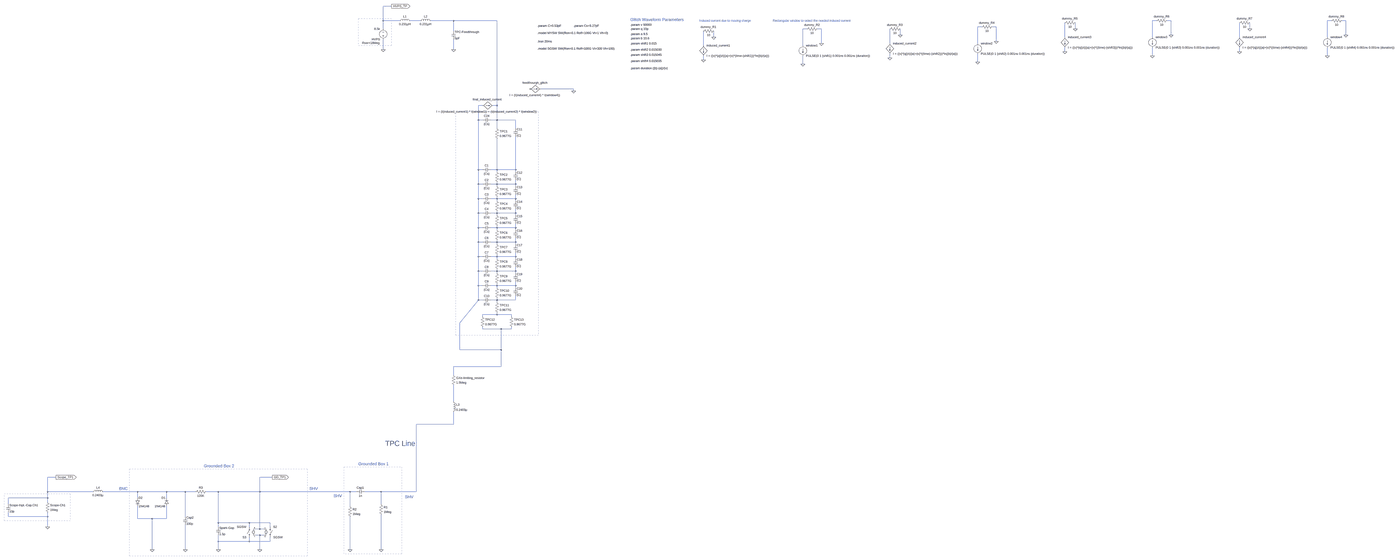
[diagram p0: schematic Feb18_glitch_current_model_miniEXO.asc, whole sheet]
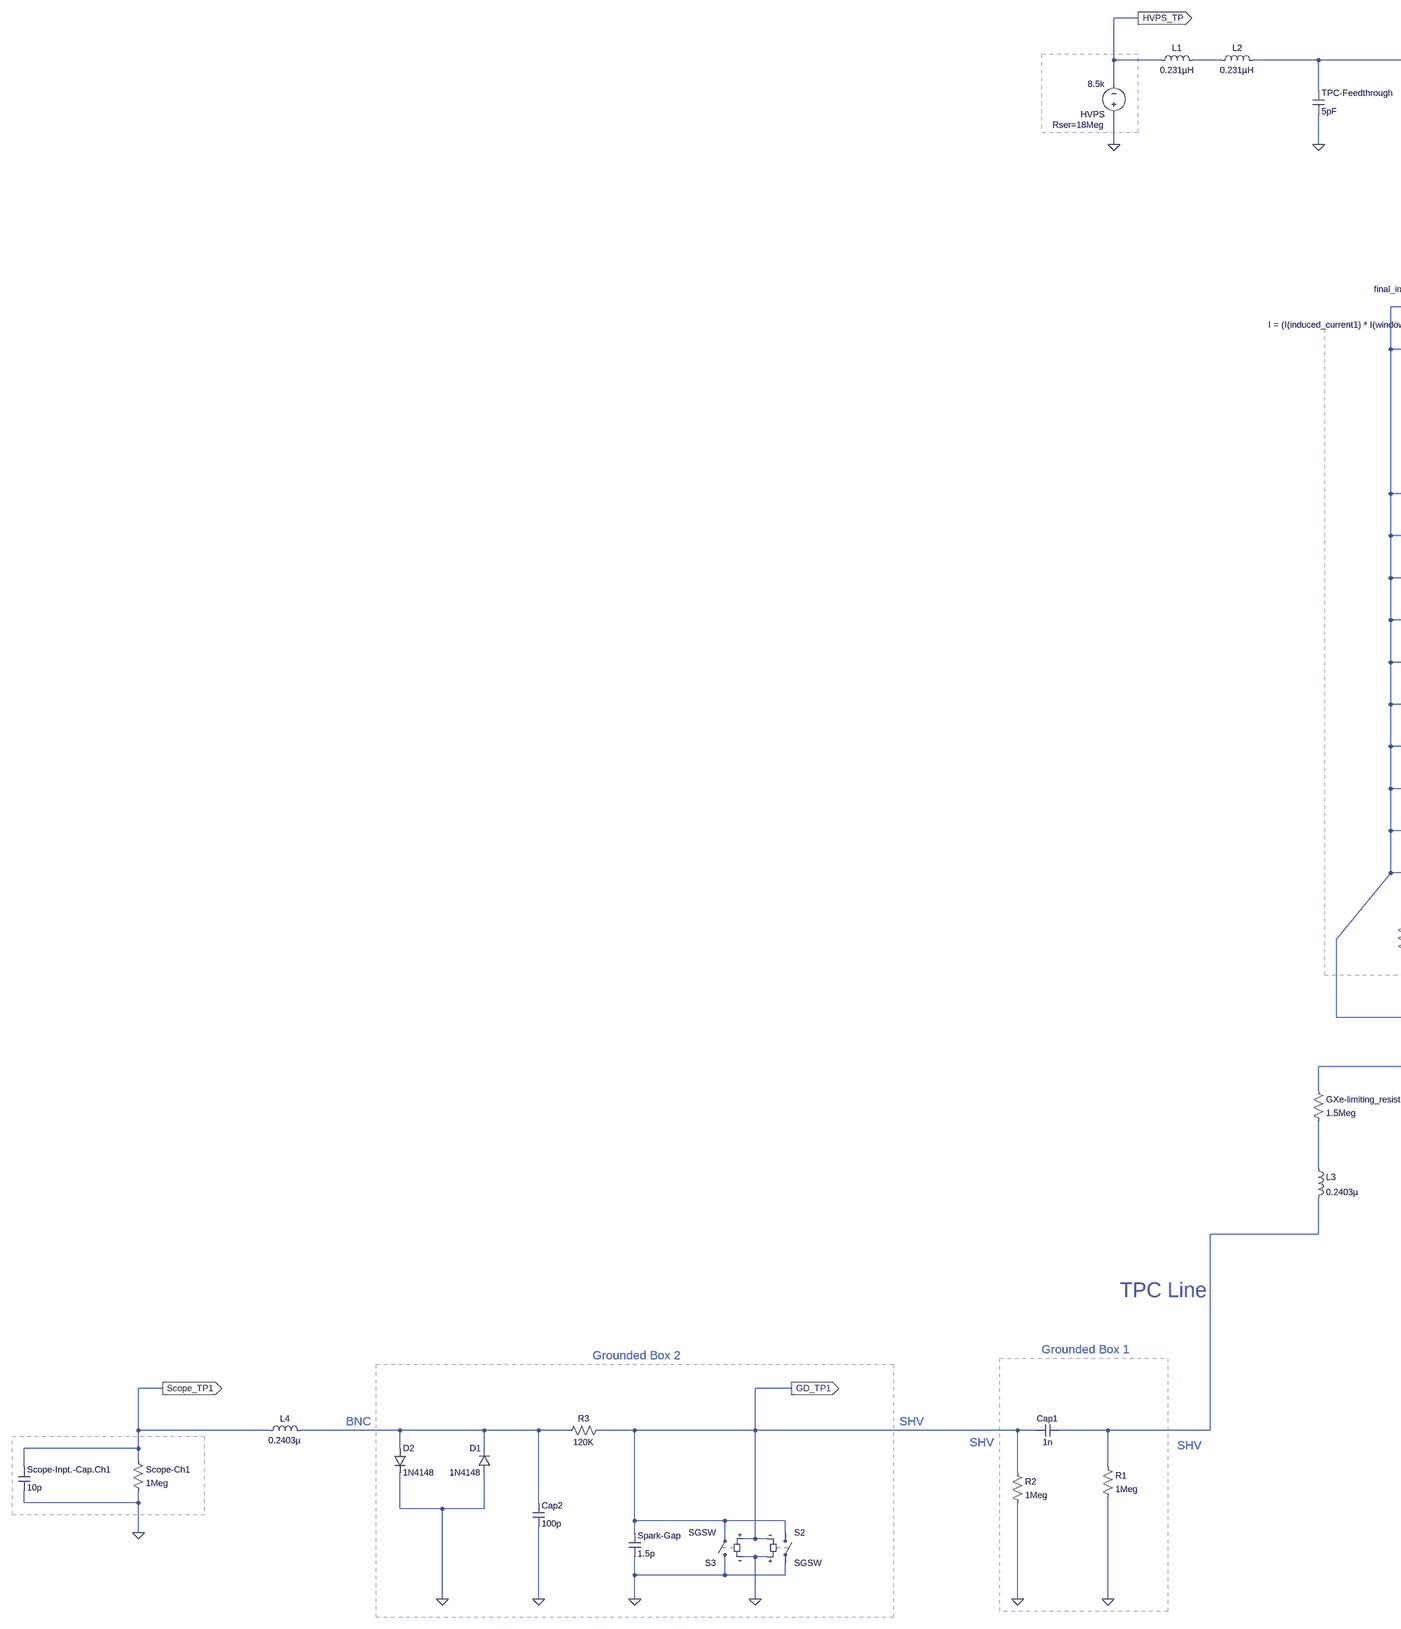
[diagram p1: schematic Feb18_glitch_current_model_miniEXO.asc, part, row 1 of 1, column 1 of 3]
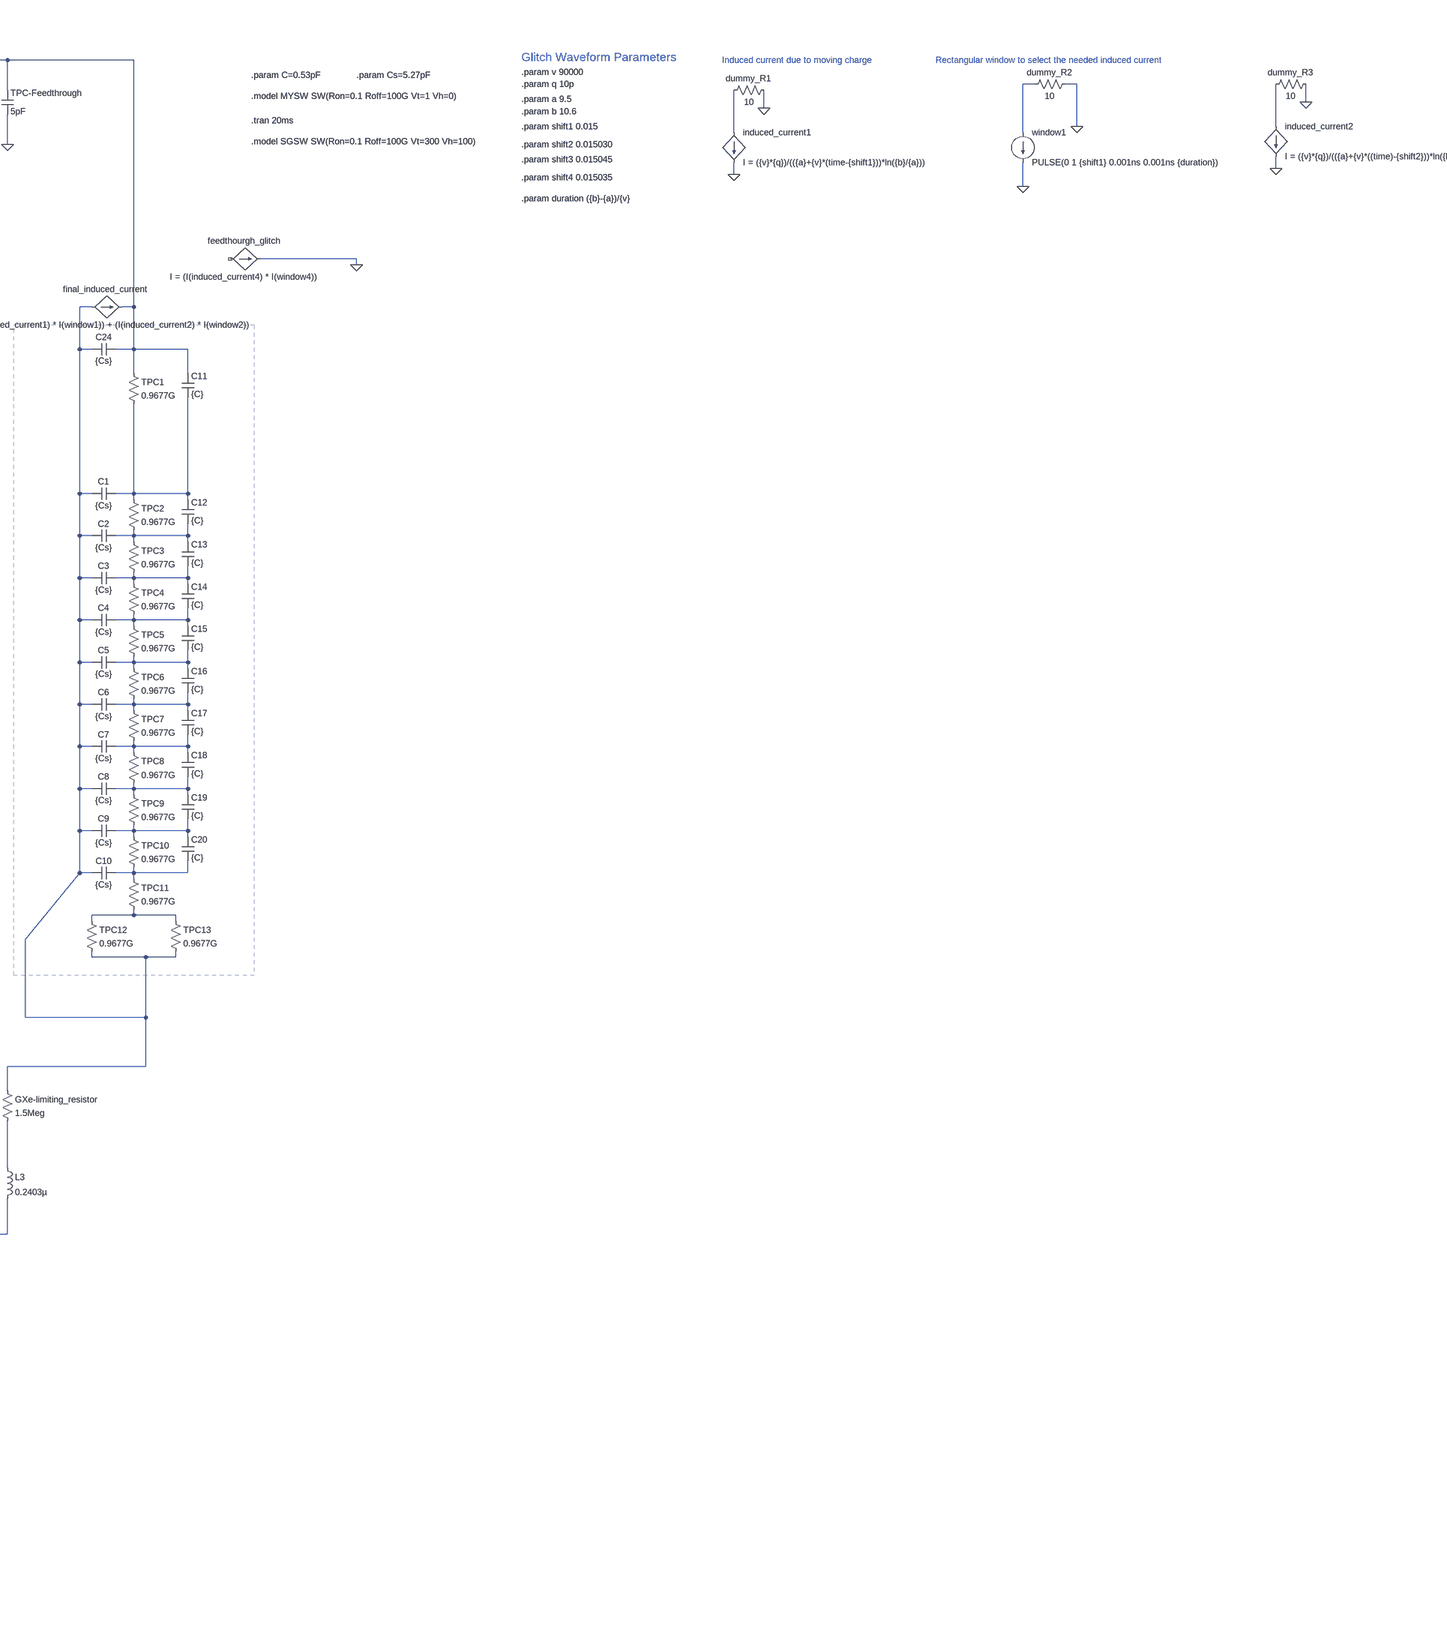
[diagram p2: schematic Feb18_glitch_current_model_miniEXO.asc, part, row 1 of 1, column 2 of 3]
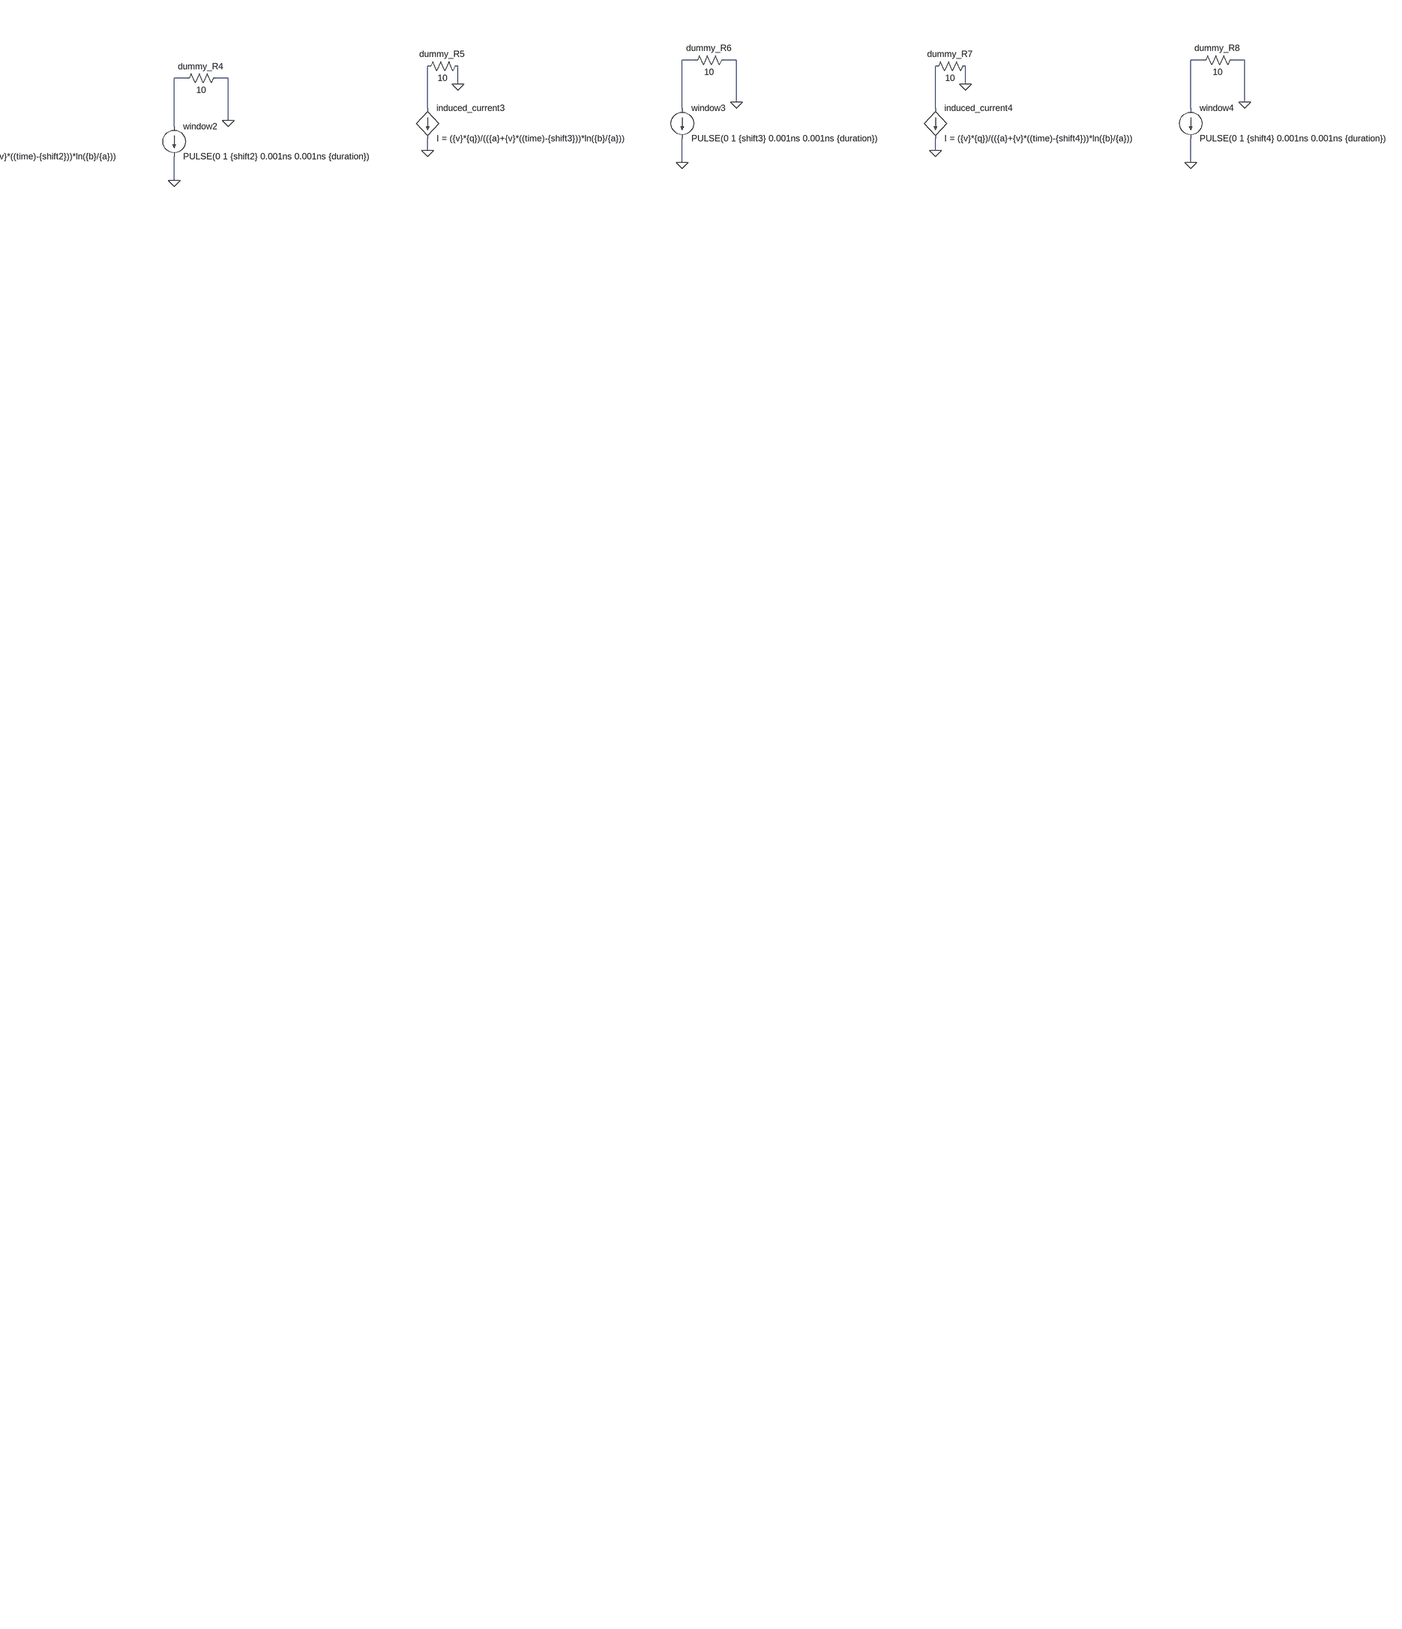
[diagram p3: schematic Feb18_glitch_current_model_miniEXO.asc, part, row 1 of 1, column 3 of 3]
Feb18_glitch_current_model_miniEXO.asc, the LTspice schematic file:
Version 4
SHEET 1 10304 3684
WIRE 224 -1072 160 -1072
WIRE 160 -960 160 -1072
WIRE 288 -960 160 -960
WIRE 448 -960 368 -960
WIRE 704 -960 528 -960
WIRE 1040 -960 704 -960
WIRE 7872 -960 7840 -960
WIRE 7984 -960 7952 -960
WIRE 9744 -960 9712 -960
WIRE 9856 -960 9824 -960
WIRE 5664 -912 5632 -912
WIRE 5776 -912 5744 -912
WIRE 160 -896 160 -960
WIRE 3904 -896 3872 -896
WIRE 4016 -896 3984 -896
WIRE 7040 -896 7040 -944
WIRE 8912 -896 8912 -944
WIRE 704 -880 704 -960
WIRE 4832 -848 4832 -896
WIRE 7984 -848 7984 -960
WIRE 9856 -848 9856 -960
WIRE 3184 -832 3184 -880
WIRE 6960 -832 6960 -944
WIRE 7840 -832 7840 -960
WIRE 8832 -832 8832 -944
WIRE 9712 -832 9712 -960
WIRE 5776 -800 5776 -912
WIRE 4016 -784 4016 -896
WIRE 4752 -784 4752 -896
WIRE 5632 -784 5632 -912
WIRE 3104 -768 3104 -880
WIRE 3872 -768 3872 -896
WIRE 160 -736 160 -816
WIRE 704 -736 704 -816
WIRE 6960 -720 6960 -752
WIRE 8832 -720 8832 -752
WIRE 7840 -688 7840 -752
WIRE 9712 -688 9712 -752
WIRE 4752 -672 4752 -704
WIRE 3104 -656 3104 -688
WIRE 5632 -640 5632 -704
WIRE 3872 -624 3872 -688
WIRE 1632 -432 1376 -432
WIRE 1632 -416 1632 -432
WIRE 928 -304 896 -304
WIRE 1040 -304 1040 -960
WIRE 1040 -304 1008 -304
WIRE 896 -192 896 -304
WIRE 928 -192 896 -192
WIRE 1040 -192 1040 -304
WIRE 1040 -192 992 -192
WIRE 1184 -192 1040 -192
WIRE 1040 -128 1040 -192
WIRE 1184 -128 1184 -192
WIRE 896 192 896 -192
WIRE 928 192 896 192
WIRE 1040 192 1040 -48
WIRE 1040 192 992 192
WIRE 1184 192 1184 -64
WIRE 1184 192 1040 192
WIRE 1040 208 1040 192
WIRE 1184 208 1184 192
WIRE 896 304 896 192
WIRE 928 304 896 304
WIRE 1040 304 1040 288
WIRE 1040 304 992 304
WIRE 1184 304 1184 272
WIRE 1184 304 1040 304
WIRE 1040 320 1040 304
WIRE 1184 320 1184 304
WIRE 896 416 896 304
WIRE 928 416 896 416
WIRE 1040 416 1040 400
WIRE 1040 416 992 416
WIRE 1184 416 1184 384
WIRE 1184 416 1040 416
WIRE 1040 432 1040 416
WIRE 1184 432 1184 416
WIRE 896 528 896 416
WIRE 928 528 896 528
WIRE 1040 528 1040 512
WIRE 1040 528 992 528
WIRE 1184 528 1184 496
WIRE 1184 528 1040 528
WIRE 1040 544 1040 528
WIRE 1184 544 1184 528
WIRE 896 640 896 528
WIRE 928 640 896 640
WIRE 1040 640 1040 624
WIRE 1040 640 992 640
WIRE 1184 640 1184 608
WIRE 1184 640 1040 640
WIRE 1040 656 1040 640
WIRE 1184 656 1184 640
WIRE 896 752 896 640
WIRE 928 752 896 752
WIRE 1040 752 1040 736
WIRE 1040 752 992 752
WIRE 1184 752 1184 720
WIRE 1184 752 1040 752
WIRE 1040 768 1040 752
WIRE 1184 768 1184 752
WIRE 896 864 896 752
WIRE 928 864 896 864
WIRE 1040 864 1040 848
WIRE 1040 864 992 864
WIRE 1184 864 1184 832
WIRE 1184 864 1040 864
WIRE 1040 880 1040 864
WIRE 1184 880 1184 864
WIRE 896 976 896 864
WIRE 928 976 896 976
WIRE 1040 976 1040 960
WIRE 1040 976 992 976
WIRE 1184 976 1184 944
WIRE 1184 976 1040 976
WIRE 1040 992 1040 976
WIRE 1184 992 1184 976
WIRE 896 1088 896 976
WIRE 928 1088 896 1088
WIRE 1040 1088 1040 1072
WIRE 1040 1088 992 1088
WIRE 1184 1088 1184 1056
WIRE 1184 1088 1040 1088
WIRE 1040 1104 1040 1088
WIRE 1184 1104 1184 1088
WIRE 896 1200 896 1088
WIRE 928 1200 896 1200
WIRE 1040 1200 1040 1184
WIRE 1040 1200 992 1200
WIRE 1184 1200 1184 1168
WIRE 1184 1200 1040 1200
WIRE 1040 1216 1040 1200
WIRE 1040 1312 1040 1296
WIRE 1040 1312 928 1312
WIRE 1152 1312 1040 1312
WIRE 928 1328 928 1312
WIRE 1152 1328 1152 1312
WIRE 752 1376 896 1200
WIRE 928 1424 928 1408
WIRE 1072 1424 928 1424
WIRE 1152 1424 1152 1408
WIRE 1152 1424 1072 1424
WIRE 752 1584 752 1376
WIRE 1072 1584 1072 1424
WIRE 1072 1584 752 1584
WIRE 1072 1792 1072 1584
WIRE 1072 1792 704 1792
WIRE 704 1856 704 1792
WIRE 704 2064 704 1936
WIRE 704 2240 704 2144
WIRE 704 2240 416 2240
WIRE -2448 3072 -2512 3072
WIRE -736 3072 -832 3072
WIRE -2512 3184 -2512 3072
WIRE -2128 3184 -2512 3184
WIRE -1776 3184 -2048 3184
WIRE -1552 3184 -1776 3184
WIRE -1408 3184 -1552 3184
WIRE -1328 3184 -1408 3184
WIRE -1152 3184 -1248 3184
WIRE -832 3184 -832 3072
WIRE -832 3184 -1152 3184
WIRE -96 3184 -832 3184
WIRE -48 3184 -96 3184
WIRE 144 3184 16 3184
WIRE 416 3184 416 2240
WIRE 416 3184 144 3184
WIRE -2512 3232 -2512 3184
WIRE -2512 3232 -2816 3232
WIRE -1776 3232 -1776 3184
WIRE -1552 3232 -1552 3184
WIRE -2512 3264 -2512 3232
WIRE -2816 3280 -2816 3232
WIRE 144 3280 144 3184
WIRE -96 3296 -96 3184
WIRE -2816 3376 -2816 3344
WIRE -2512 3376 -2512 3344
WIRE -2512 3376 -2816 3376
WIRE -1408 3376 -1408 3184
WIRE -1776 3392 -1776 3296
WIRE -1664 3392 -1776 3392
WIRE -1552 3392 -1552 3296
WIRE -1552 3392 -1664 3392
WIRE -1152 3424 -1152 3184
WIRE -912 3424 -1152 3424
WIRE -752 3424 -912 3424
WIRE -2512 3456 -2512 3376
WIRE -1152 3456 -1152 3424
WIRE -912 3456 -912 3424
WIRE -752 3456 -752 3424
WIRE -832 3472 -832 3184
WIRE -832 3472 -864 3472
WIRE -800 3472 -832 3472
WIRE -832 3520 -864 3520
WIRE -800 3520 -832 3520
WIRE -1152 3568 -1152 3520
WIRE -912 3568 -912 3536
WIRE -912 3568 -1152 3568
WIRE -752 3568 -752 3536
WIRE -752 3568 -912 3568
WIRE -1664 3632 -1664 3392
WIRE -1408 3632 -1408 3440
WIRE -1152 3632 -1152 3568
WIRE -832 3632 -832 3520
WIRE -96 3632 -96 3376
WIRE 144 3632 144 3360
FLAG -2512 3456 0
FLAG 160 -736 0
FLAG -1152 3632 0
FLAG -832 3632 0
FLAG -2448 3072 Scope_TP1
IOPIN -2448 3072 Out
FLAG -736 3072 GD_TP1
IOPIN -736 3072 Out
FLAG 224 -1072 HVPS_TP
IOPIN 224 -1072 Out
FLAG 704 -736 0
FLAG -1408 3632 0
FLAG -1664 3632 0
FLAG 144 3632 0
FLAG -96 3632 0
FLAG 3104 -656 0
FLAG 3184 -832 0
FLAG 4016 -784 0
FLAG 3872 -624 0
FLAG 4752 -672 0
FLAG 4832 -848 0
FLAG 5776 -800 0
FLAG 5632 -640 0
FLAG 6960 -720 0
FLAG 7040 -896 0
FLAG 7984 -848 0
FLAG 7840 -688 0
FLAG 8832 -720 0
FLAG 8912 -896 0
FLAG 9856 -848 0
FLAG 9712 -688 0
FLAG 1632 -416 0
SYMBOL res -2528 3248 R0
SYMATTR InstName Scope-Ch1
SYMATTR Value 1Meg
SYMATTR SpiceLine tol=1 pwr=0.5
SYMBOL voltage 160 -800 R180
WINDOW 123 0 0 Left 0
WINDOW 39 24 -12 Left 2
SYMATTR SpiceLine Rser=18Meg
SYMATTR InstName HVPS
SYMATTR Value 8.5k
SYMBOL res 1024 -144 R0
SYMATTR InstName TPC1
SYMATTR Value 0.9677G
SYMBOL res 1024 192 R0
SYMATTR InstName TPC2
SYMATTR Value 0.9677G
SYMBOL res 1024 304 R0
SYMATTR InstName TPC3
SYMATTR Value 0.9677G
SYMBOL res 1024 416 R0
SYMATTR InstName TPC4
SYMATTR Value 0.9677G
SYMBOL res 1024 528 R0
SYMATTR InstName TPC5
SYMATTR Value 0.9677G
SYMBOL res 1024 640 R0
SYMATTR InstName TPC6
SYMATTR Value 0.9677G
SYMBOL res 1024 752 R0
SYMATTR InstName TPC7
SYMATTR Value 0.9677G
SYMBOL res 1024 864 R0
SYMATTR InstName TPC8
SYMATTR Value 0.9677G
SYMBOL res 912 1312 R0
SYMATTR InstName TPC12
SYMATTR Value 0.9677G
SYMBOL res 1136 1312 R0
SYMATTR InstName TPC13
SYMATTR Value 0.9677G
SYMBOL res 1024 976 R0
SYMATTR InstName TPC9
SYMATTR Value 0.9677G
SYMBOL res 1024 1088 R0
SYMATTR InstName TPC10
SYMATTR Value 0.9677G
SYMBOL res 1024 1200 R0
SYMATTR InstName TPC11
SYMATTR Value 0.9677G
SYMBOL cap 992 176 R90
WINDOW 0 0 32 VBottom 2
WINDOW 3 32 32 VTop 2
SYMATTR InstName C1
SYMATTR Value {Cs}
SYMBOL cap 992 288 R90
WINDOW 0 0 32 VBottom 2
WINDOW 3 32 32 VTop 2
SYMATTR InstName C2
SYMATTR Value {Cs}
SYMBOL cap 992 400 R90
WINDOW 0 0 32 VBottom 2
WINDOW 3 32 32 VTop 2
SYMATTR InstName C3
SYMATTR Value {Cs}
SYMBOL cap 992 512 R90
WINDOW 0 0 32 VBottom 2
WINDOW 3 32 32 VTop 2
SYMATTR InstName C4
SYMATTR Value {Cs}
SYMBOL cap 992 624 R90
WINDOW 0 0 32 VBottom 2
WINDOW 3 32 32 VTop 2
SYMATTR InstName C5
SYMATTR Value {Cs}
SYMBOL cap 992 736 R90
WINDOW 0 0 32 VBottom 2
WINDOW 3 32 32 VTop 2
SYMATTR InstName C6
SYMATTR Value {Cs}
SYMBOL cap 992 848 R90
WINDOW 0 0 32 VBottom 2
WINDOW 3 32 32 VTop 2
SYMATTR InstName C7
SYMATTR Value {Cs}
SYMBOL cap 992 960 R90
WINDOW 0 0 32 VBottom 2
WINDOW 3 32 32 VTop 2
SYMATTR InstName C8
SYMATTR Value {Cs}
SYMBOL cap 992 1072 R90
WINDOW 0 0 32 VBottom 2
WINDOW 3 32 32 VTop 2
SYMATTR InstName C9
SYMATTR Value {Cs}
SYMBOL cap 992 1184 R90
WINDOW 0 0 32 VBottom 2
WINDOW 3 32 32 VTop 2
SYMATTR InstName C10
SYMATTR Value {Cs}
SYMBOL cap 1168 -128 R0
SYMATTR InstName C11
SYMATTR Value {C}
SYMBOL cap 1168 208 R0
SYMATTR InstName C12
SYMATTR Value {C}
SYMBOL cap 1168 320 R0
SYMATTR InstName C13
SYMATTR Value {C}
SYMBOL cap 1168 432 R0
SYMATTR InstName C14
SYMATTR Value {C}
SYMBOL cap 1168 544 R0
SYMATTR InstName C15
SYMATTR Value {C}
SYMBOL cap 1168 656 R0
SYMATTR InstName C16
SYMATTR Value {C}
SYMBOL cap 1168 768 R0
SYMATTR InstName C17
SYMATTR Value {C}
SYMBOL cap 1168 880 R0
SYMATTR InstName C18
SYMATTR Value {C}
SYMBOL cap 1168 992 R0
SYMATTR InstName C19
SYMATTR Value {C}
SYMBOL cap 1168 1104 R0
SYMATTR InstName C20
SYMATTR Value {C}
SYMBOL cap -1168 3456 R0
SYMATTR InstName Spark-Gap
SYMATTR Value 1.5p
SYMATTR SpiceLine Rpar=1G
SYMBOL cap 992 -208 R90
WINDOW 0 0 32 VBottom 2
WINDOW 3 32 32 VTop 2
SYMATTR InstName C24
SYMATTR Value {Cs}
SYMBOL cap -2832 3280 R0
SYMATTR InstName Scope-Inpt.-Cap.Ch1
SYMATTR Value 10p
SYMBOL sw -912 3552 R180
SYMATTR InstName S3
SYMATTR Value SGSW
SYMBOL sw -752 3440 R0
SYMATTR InstName S2
SYMATTR Value SGSW
SYMBOL ind 272 -944 R270
WINDOW 0 32 56 VTop 2
WINDOW 3 5 56 VBottom 2
SYMATTR InstName L1
SYMATTR Value 0.231µH
SYMATTR SpiceLine Rser=0.0051 Cpar=92.4pF
SYMBOL ind 432 -944 R270
WINDOW 0 32 56 VTop 2
WINDOW 3 5 56 VBottom 2
SYMATTR InstName L2
SYMATTR Value 0.231µH
SYMATTR SpiceLine Rser=0.0051 Cpar=92.4pF
SYMBOL ind -2144 3200 R270
WINDOW 0 32 56 VTop 2
WINDOW 3 5 56 VBottom 2
SYMATTR InstName L4
SYMATTR Value 0.2403µ
SYMATTR SpiceLine Rser=0.0315 Cpar=86.4p
SYMBOL cap 688 -880 R0
SYMATTR InstName TPC-Feedthrough
SYMATTR Value 5pF
SYMBOL res 688 1840 R0
SYMATTR InstName GXe-limiting_resistor
SYMATTR Value 1.5Meg
SYMATTR SpiceLine tol=1 pwr=0.5
SYMBOL ind 688 2048 R0
SYMATTR InstName L3
SYMATTR Value 0.2403µ
SYMBOL cap 16 3168 R90
WINDOW 0 0 32 VBottom 2
WINDOW 3 32 32 VTop 2
SYMATTR InstName Cap1
SYMATTR Value 1n
SYMBOL res -1232 3168 R90
WINDOW 0 0 56 VBottom 2
WINDOW 3 32 56 VTop 2
SYMATTR InstName R3
SYMATTR Value 120K
SYMBOL cap -1424 3376 R0
SYMATTR InstName Cap2
SYMATTR Value 100p
SYMBOL diode -1536 3296 R180
WINDOW 0 24 64 Left 2
WINDOW 3 24 0 Left 2
SYMATTR InstName D1
SYMATTR Value 1N4148
SYMBOL diode -1792 3232 R0
SYMATTR InstName D2
SYMATTR Value 1N4148
SYMBOL res 128 3264 R0
SYMATTR InstName R1
SYMATTR Value 1Meg
SYMBOL res -112 3280 R0
SYMATTR InstName R2
SYMATTR Value 1Meg
SYMBOL bi 3104 -768 R0
SYMATTR InstName induced_current1
SYMATTR Value I = ({v}*{q})/(({a}+{v}*(time-{shift1}))*ln({b}/{a}))
SYMBOL res 3200 -896 R90
WINDOW 0 0 56 VBottom 2
WINDOW 3 32 56 VTop 2
SYMATTR InstName dummy_R1
SYMATTR Value 10
SYMBOL res 4000 -912 R90
WINDOW 0 0 56 VBottom 2
WINDOW 3 32 56 VTop 2
SYMATTR InstName dummy_R2
SYMATTR Value 10
SYMBOL current 3872 -768 R0
WINDOW 123 0 0 Left 0
WINDOW 39 0 0 Left 0
SYMATTR InstName window1
SYMATTR Value PULSE(0 1 {shift1} 0.001ns 0.001ns {duration})
SYMBOL bi 928 -304 R270
WINDOW 0 32 40 VTop 2
WINDOW 3 -32 40 VBottom 2
SYMATTR InstName final_induced_current
SYMATTR Value I = (I(induced_current1) * I(window1)) + (I(induced_current2) * I(window2))
SYMBOL bi 4752 -784 R0
SYMATTR InstName induced_current2
SYMATTR Value I = ({v}*{q})/(({a}+{v}*((time)-{shift2}))*ln({b}/{a}))
SYMBOL res 4848 -912 R90
WINDOW 0 0 56 VBottom 2
WINDOW 3 32 56 VTop 2
SYMATTR InstName dummy_R3
SYMATTR Value 10
SYMBOL res 5760 -928 R90
WINDOW 0 0 56 VBottom 2
WINDOW 3 32 56 VTop 2
SYMATTR InstName dummy_R4
SYMATTR Value 10
SYMBOL current 5632 -784 R0
WINDOW 123 0 0 Left 0
WINDOW 39 0 0 Left 0
SYMATTR InstName window2
SYMATTR Value PULSE(0 1 {shift2} 0.001ns 0.001ns {duration})
SYMBOL bi 6960 -832 R0
SYMATTR InstName induced_current3
SYMATTR Value I = ({v}*{q})/(({a}+{v}*((time)-{shift3}))*ln({b}/{a}))
SYMBOL res 7056 -960 R90
WINDOW 0 0 56 VBottom 2
WINDOW 3 32 56 VTop 2
SYMATTR InstName dummy_R5
SYMATTR Value 10
SYMBOL res 7968 -976 R90
WINDOW 0 0 56 VBottom 2
WINDOW 3 32 56 VTop 2
SYMATTR InstName dummy_R6
SYMATTR Value 10
SYMBOL current 7840 -832 R0
WINDOW 123 0 0 Left 0
WINDOW 39 0 0 Left 0
SYMATTR InstName window3
SYMATTR Value PULSE(0 1 {shift3} 0.001ns 0.001ns {duration})
SYMBOL bi 8832 -832 R0
SYMATTR InstName induced_current4
SYMATTR Value I = ({v}*{q})/(({a}+{v}*((time)-{shift4}))*ln({b}/{a}))
SYMBOL res 8928 -960 R90
WINDOW 0 0 56 VBottom 2
WINDOW 3 32 56 VTop 2
SYMATTR InstName dummy_R7
SYMATTR Value 10
SYMBOL res 9840 -976 R90
WINDOW 0 0 56 VBottom 2
WINDOW 3 32 56 VTop 2
SYMATTR InstName dummy_R8
SYMATTR Value 10
SYMBOL current 9712 -832 R0
WINDOW 123 0 0 Left 0
WINDOW 39 0 0 Left 0
SYMATTR InstName window4
SYMATTR Value PULSE(0 1 {shift4} 0.001ns 0.001ns {duration})
SYMBOL bi2 1376 -432 R90
WINDOW 0 -32 40 VBottom 2
WINDOW 3 32 40 VTop 2
SYMATTR InstName feedthourgh_glitch
SYMATTR Value I = (I(induced_current4) * I(window4))
TEXT 1352 -800 Left 2 !.tran 20ms
TEXT 1352 -864 Left 2 !.model MYSW SW(Ron=0.1 Roff=100G Vt=1 Vh=0)
TEXT 1352 -920 Left 2 !.param C=0.53pF
TEXT 1632 -920 Left 2 !.param Cs=5.27pF
TEXT 1352 -744 Left 2 !.model SGSW SW(Ron=0.1 Roff=100G Vt=300 Vh=100)
TEXT 176 2776 Left 5 ;TPC Line
TEXT 328 3224 Left 3 ;SHV
TEXT -224 3216 Left 3 ;SHV
TEXT -448 3160 Left 3 ;SHV
TEXT -1920 3160 Left 3 ;BNC
TEXT -32 2968 Left 3 ;Grounded Box 1
TEXT -1264 2984 Left 3 ;Grounded Box 2
TEXT 2296 -928 Left 2 !.param v 90000
TEXT 2296 -896 Left 2 !.param q 10p
TEXT 2296 -856 Left 2 !.param a 9.5
TEXT 2296 -824 Left 2 !.param b 10.6
TEXT 2296 -968 Left 3 ;Glitch Waveform Parameters
TEXT 3072 -960 Left 2 ;Induced current due to moving charge
TEXT 3640 -960 Left 2 ;Rectangular window to select the needed induced current
TEXT 2296 -784 Left 2 !.param shift1 0.015
TEXT 2296 -592 Left 2 !.param duration ({b}-{a})/{v}
TEXT 2296 -736 Left 2 !.param shift2 0.015030
TEXT 2296 -696 Left 2 !.param shift3 0.015045
TEXT 2296 -648 Left 2 !.param shift4 0.015035
RECTANGLE Normal -32 -768 224 -976 2
RECTANGLE Normal -2336 3408 -2848 3200 2
RECTANGLE Normal 1360 1472 720 -256 2
RECTANGLE Normal -464 3680 -1840 3008 2
RECTANGLE Normal 304 3664 -144 2992 2

The netlist it stands for:
* Feb18_glitch_current_model_miniEXO.asc
R§Scope-Ch1 Scope_TP1 0 1Meg tol=1 pwr=0.5
V§HVPS 0 HVPS_TP 8.5k Rser=18Meg
R§TPC1 N002 N012 0.9677G
R§TPC2 N012 N013 0.9677G
R§TPC3 N013 N014 0.9677G
R§TPC4 N014 N015 0.9677G
R§TPC5 N015 N016 0.9677G
R§TPC6 N016 N017 0.9677G
R§TPC7 N017 N018 0.9677G
R§TPC8 N018 N019 0.9677G
R§TPC12 N022 N011 0.9677G
R§TPC13 N022 N011 0.9677G
R§TPC9 N019 N020 0.9677G
R§TPC10 N020 N021 0.9677G
R§TPC11 N021 N022 0.9677G
C1 N012 N011 {Cs}
C2 N013 N011 {Cs}
C3 N014 N011 {Cs}
C4 N015 N011 {Cs}
C5 N016 N011 {Cs}
C6 N017 N011 {Cs}
C7 N018 N011 {Cs}
C8 N019 N011 {Cs}
C9 N020 N011 {Cs}
C10 N021 N011 {Cs}
C11 N002 N012 {C}
C12 N012 N013 {C}
C13 N013 N014 {C}
C14 N014 N015 {C}
C15 N015 N016 {C}
C16 N016 N017 {C}
C17 N017 N018 {C}
C18 N018 N019 {C}
C19 N019 N020 {C}
C20 N020 N021 {C}
C§Spark-Gap GD_TP1 0 1.5p Rpar=1G
C24 N002 N011 {Cs}
C§Scope-Inpt.-Cap.Ch1 Scope_TP1 0 10p
S3 0 GD_TP1 GD_TP1 0 SGSW
S2 GD_TP1 0 0 GD_TP1 SGSW
L1 HVPS_TP N001 0.231µH Rser=0.0051 Cpar=92.4pF
L2 N001 N002 0.231µH Rser=0.0051 Cpar=92.4pF
L4 Scope_TP1 N025 0.2403µ Rser=0.0315 Cpar=86.4p
C§TPC-Feedthrough N002 0 5pF
R§GXe-limiting_resistor N011 N023 1.5Meg tol=1 pwr=0.5
L3 N023 N024 0.2403µ
Cap1 N024 GD_TP1 1n
R3 GD_TP1 N025 120K
Cap2 N025 0 100p
D1 0 N025 1N4148
D2 N025 0 1N4148
R1 N024 0 1Meg
R2 GD_TP1 0 1Meg
B§induced_current1 N010 0 I = ({v}*{q})/(({a}+{v}*(time-{shift1}))*ln({b}/{a}))
R§dummy_R1 0 N010 10
R§dummy_R2 0 N006 10
I§window1 N006 0 PULSE(0 1 {shift1} 0.001ns 0.001ns {duration})
B§final_induced_current N011 N002 I = (I(induced_current1) * I(window1)) + (I(induced_current2) * I(window2))
B§induced_current2 N009 0 I = ({v}*{q})/(({a}+{v}*((time)-{shift2}))*ln({b}/{a}))
R§dummy_R3 0 N009 10
R§dummy_R4 0 N005 10
I§window2 N005 0 PULSE(0 1 {shift2} 0.001ns 0.001ns {duration})
B§induced_current3 N007 0 I = ({v}*{q})/(({a}+{v}*((time)-{shift3}))*ln({b}/{a}))
R§dummy_R5 0 N007 10
R§dummy_R6 0 N003 10
I§window3 N003 0 PULSE(0 1 {shift3} 0.001ns 0.001ns {duration})
B§induced_current4 N008 0 I = ({v}*{q})/(({a}+{v}*((time)-{shift4}))*ln({b}/{a}))
R§dummy_R7 0 N008 10
R§dummy_R8 0 N004 10
I§window4 N004 0 PULSE(0 1 {shift4} 0.001ns 0.001ns {duration})
B§feedthourgh_glitch NC_01 0 I = (I(induced_current4) * I(window4))
.model D D
.lib standard.dio
.tran 20ms
.model MYSW SW(Ron=0.1 Roff=100G Vt=1 Vh=0)
.param C=0.53pF
.param Cs=5.27pF
.model SGSW SW(Ron=0.1 Roff=100G Vt=300 Vh=100)
* TPC Line
* SHV
* SHV
* SHV
* BNC
* Grounded Box 1
* Grounded Box 2
.param v 90000
.param q 10p
.param a 9.5
.param b 10.6
* Glitch Waveform Parameters
* Induced current due to moving charge
* Rectangular window to select the needed induced current
.param shift1 0.015
.param duration ({b}-{a})/{v}
.param shift2 0.015030
.param shift3 0.015045
.param shift4 0.015035
.backanno
.end